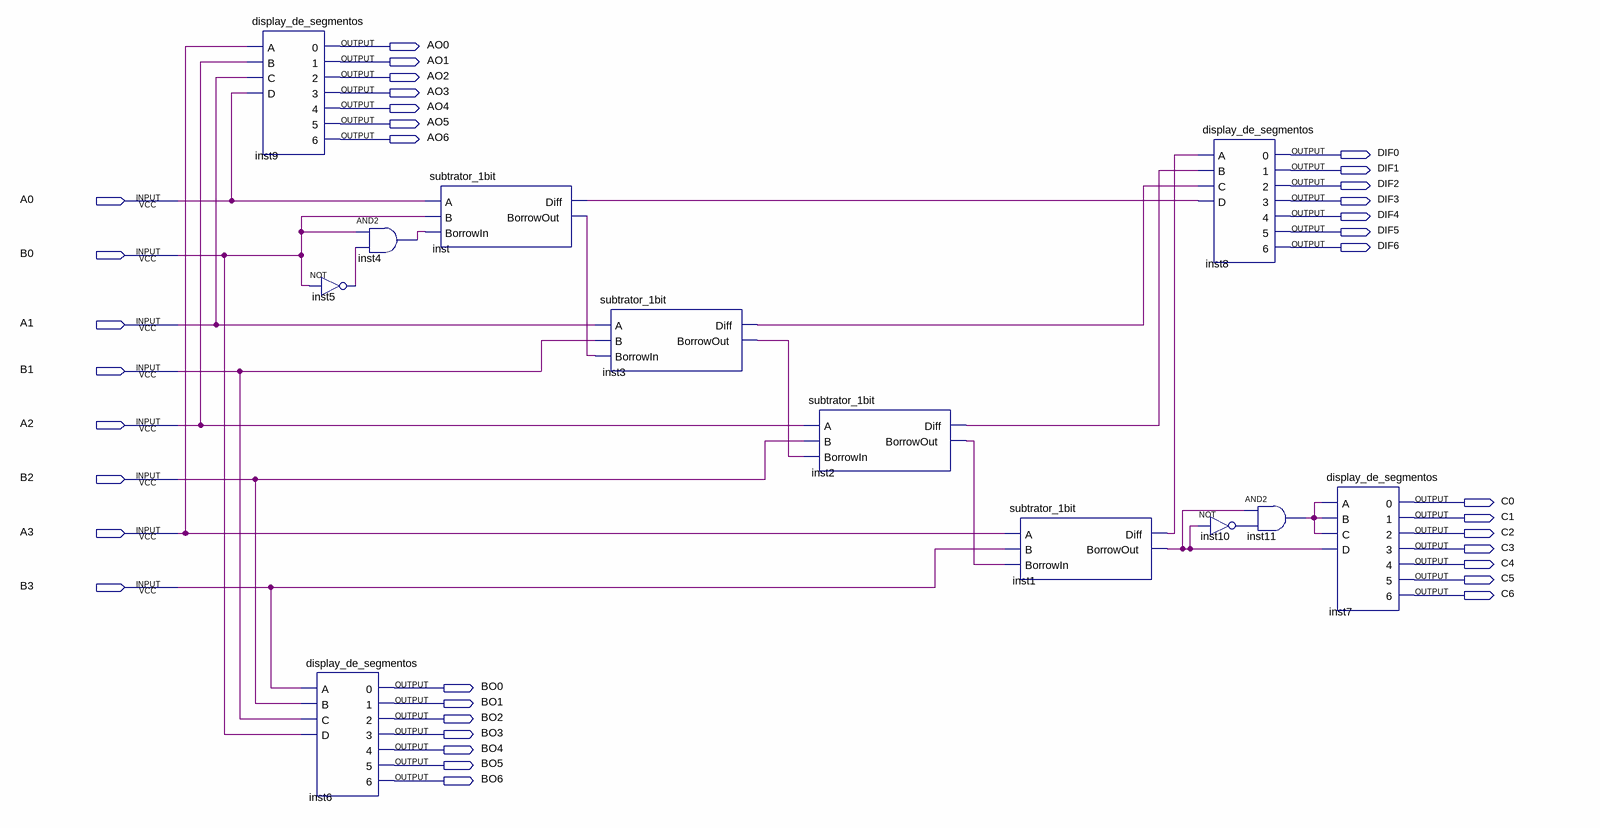
[diagram p0: schematic sheet]
// Quartus schematic subtrator_4bit.bdf as structural Verilog: 12 symbols, 36 pins
module subtrator_4bit (
  input  A0,
  input  B0,
  input  A1,
  input  B1,
  input  A2,
  input  B2,
  input  A3,
  input  B3,
  output AO0,
  output AO1,
  output AO2,
  output AO3,
  output AO4,
  output AO5,
  output AO6,
  output DIF0,
  output DIF1,
  output DIF2,
  output DIF3,
  output DIF4,
  output DIF5,
  output DIF6,
  output C0,
  output C1,
  output C2,
  output C3,
  output C4,
  output C5,
  output C6,
  output BO0,
  output BO1,
  output BO2,
  output BO3,
  output BO4,
  output BO5,
  output BO6
);

  wire inst1_borrowout, inst1_diff, inst2_borrowout, inst2_diff, inst3_borrowout, inst3_diff, inst4_out,
       inst5_out, inst10_out, inst11_out, inst_borrowout, inst_diff;

  display_de_segmentos inst9 (
    .A(A3), .B(A2), .C(A1), .D(A0), .\0 (AO0), .\1 (AO1), .\2 (AO2), .\3 (AO3), .\4 (AO4), .\5 (AO5),
    .\6 (AO6));
  display_de_segmentos inst6 (
    .A(B3), .B(B2), .C(B1), .D(B0), .\0 (BO0), .\1 (BO1), .\2 (BO2), .\3 (BO3), .\4 (BO4), .\5 (BO5),
    .\6 (BO6));
  and inst4 (inst4_out, B0, inst5_out);
  not inst5 (inst5_out, B0);
  subtrator_1bit inst (.A(A0), .B(B0), .BorrowIn(inst4_out), .Diff(inst_diff), .BorrowOut(inst_borrowout));
  subtrator_1bit inst3 (.A(A1), .B(B1), .BorrowIn(inst_borrowout), .Diff(inst3_diff), .BorrowOut(inst3_borrowout));
  subtrator_1bit inst2 (.A(A2), .B(B2), .BorrowIn(inst3_borrowout), .Diff(inst2_diff), .BorrowOut(inst2_borrowout));
  subtrator_1bit inst1 (.A(A3), .B(B3), .BorrowIn(inst2_borrowout), .Diff(inst1_diff), .BorrowOut(inst1_borrowout));
  display_de_segmentos inst8 (
    .A(inst1_diff), .B(inst2_diff), .C(inst3_diff), .D(inst_diff), .\0 (DIF0), .\1 (DIF1), .\2 (DIF2),
    .\3 (DIF3), .\4 (DIF4), .\5 (DIF5), .\6 (DIF6));
  not inst10 (inst10_out, inst1_borrowout);
  and inst11 (inst11_out, inst1_borrowout, inst10_out);
  display_de_segmentos inst7 (
    .A(inst11_out), .B(inst11_out), .C(inst11_out), .D(inst1_borrowout), .\0 (C0), .\1 (C1), .\2 (C2),
    .\3 (C3), .\4 (C4), .\5 (C5), .\6 (C6));
endmodule
